# Altium schematic sheet FrontDoorConnecteur.SchDoc
size Letter; Organization: Cegep Limoilou; Address1: 1300, 8e Avenue; Address2: Québec, QC; Address3: Canada; Address4: G1J 5L5; Revision: Enseignants; SheetNumber: 2; SheetTotal: 8; Conception: Ilyes Gharmoul; Titre: Connecteur FrontDoor; Modification: Ilyes G
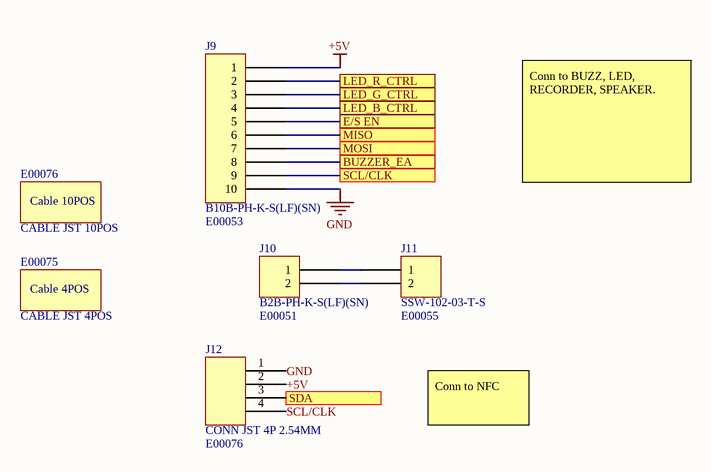
[diagram p0: FrontDoorConnecteur.SchDoc]

## Parts
H1  CABLE JST 10POS  ADAM Inventory Number 1: E00076
H2  CABLE JST 4POS  ADAM Inventory Number 1: E00075
J9  B10B-PH-K-S(LF)(SN)  ADAM Inventory Number 1: E00053  [CONN JST 10PIN]
J10  B2B-PH-K-S(LF)(SN)  ADAM Inventory Number 1: E00051  [CONN JST 2PIN]
J11  SSW-102-03-T-S  ADAM Inventory Number 1: E00055  [CONN FEM HEADER 2PIN]
J12  CONN JST 4P 2.54MM  ADAM Inventory Number 1: E00076  [MOLEX KK 0022272041]

## Ports
BUZZER_EA, E/S EN, LED_B_CTRL, LED_G_CTRL, LED_R_CTRL, MISO, MOSI, SCL/CLK, SDA

## Nets
+5V: J9.1 J12.2
GND: J9.10 J12.1
BUZZER_EA: J9.8 ; port BUZZER_EA
E/S EN: J9.5 ; port E/S EN
LED_B_CTRL: J9.4 ; port LED_B_CTRL
LED_G_CTRL: J9.3 ; port LED_G_CTRL
LED_R_CTRL: J9.2 ; port LED_R_CTRL
MISO: J9.6 ; port MISO
MOSI: J9.7 ; port MOSI
SCL/CLK: J9.9 ; port SCL/CLK
SCL/CLK: J12.4  [a separate net that carries the same name]
SDA: J12.3 ; port SDA
NetJ10_1: J10.1 J11.1
NetJ10_2: J10.2 J11.2

## Notes on the sheet
- Conn to BUZZ, LED, RECORDER, SPEAKER.
- Conn to NFC
- Titre :
- Conception :
- Date :
- Modification :
- Heure :
- Révision :
- Feuille
- de
- Fichier :
- (in symbol CABLE JST 4POS NOFP) Cable 4POS
- (in symbol CABLE JST 10POS NOFP) Cable 10POS

## Library data of the parts
H1 = CABLE JST 10POS NOFP: No footprint, only for BOM; Manufacturer Part Number 1: A10KR10KR26E254A; Supplier 1: Digi-Key; Supplier Part Number 1: 455-3496-ND
H2 = CABLE JST 4POS NOFP: Manufacturer Part Number 1: 2177961041; Supplier 1: Mouser; Supplier Part Number 1: 538-217796-1041
J9 = CONN JST 10POS TH: CONN HEADER VERT 10POS 2MM; Manufacturer: JST Sales America Inc.; Contact Length - Mating: 0.130" (3.30mm); Contact Length - Post: 0.134" (3.40mm); Current Rating (Amps): 2A; Material Flammability Rating: UL94 V-0; Number of Positions: 10; Number of Positions Loaded: All; Overall Contact Length: 0.333" (8.45mm); Pitch - Mating: 0.079" (2.00mm); Shrouding: Shrouded - 4 Wall; Style: Board to Cable/Wire; Voltage Rating: 100V; Manufacturer Part Number 1: B10B-PH-K-S(LF)(SN); ComponentLink1Description: Datasheet; ComponentLink1URL: http://www.jst-mfg.com/product/pdf/eng/ePH.pdf; ComponentLink2Description: DigiKey Link; ComponentLink2URL: http://digikey.com/product-detail/en/jst-sales-america-inc/B10B-PH-K-S-LF-SN/455-1712-ND/926619; Connector Type: Header; Contact Finish - Mating: Tin; Contact Finish - Post: Tin; Contact Material: Brass; Contact Shape: Square; Contact Type: Male Pin; Fastening Type: Detent Lock; Insulation Color: Natural; Insulation Height: 0.236" (6.00mm); Insulation Material: Polyamide (PA66), Nylon 6/6; LastUpdated: 2020-01-12 22:31:09; Lifecycle Status: Active; Minimum Order: 1; Mounting Type: Through Hole; Number of Rows: 1; Operating Temperature: -25°C ~ 85°C; Packaging: Bulk; PartId: 33; Part Status: Active; Price: 0.46; Series: PH; Supplier 1: DigiKey; Supplier Part Number 1: 455-1712-ND; Termination: Press-Fit, Solder
J10 = CONN JST 2PIN TH: CONN HEADER VERT 2POS 2MM; Manufacturer: JST Sales America Inc.; Contact Length - Mating: 0.130" (3.30mm); Contact Length - Post: 0.134" (3.40mm); Current Rating (Amps): 2A; Material Flammability Rating: UL94 V-0; Number of Positions: 2; Number of Positions Loaded: All; Overall Contact Length: 0.333" (8.45mm); Pitch - Mating: 0.079" (2.00mm); Shrouding: Shrouded - 4 Wall; Style: Board to Cable/Wire; Voltage Rating: 100V; Manufacturer Part Number 1: B2B-PH-K-S(LF)(SN); ComponentLink1Description: Datasheet; ComponentLink1URL: http://www.jst-mfg.com/product/pdf/eng/ePH.pdf; ComponentLink2Description: DigiKey Link; ComponentLink2URL: http://digikey.com/product-detail/en/jst-sales-america-inc/B2B-PH-K-S-LF-SN/455-1704-ND/926611; Connector Type: Header; Contact Finish - Mating: Tin; Contact Finish - Post: Tin; Contact Material: Brass; Contact Shape: Square; Contact Type: Male Pin; Fastening Type: Detent Lock; Insulation Color: Natural; Insulation Height: 0.236" (6.00mm); Insulation Material: Polyamide (PA66), Nylon 6/6; LastUpdated: 2020-01-03 23:40:58; Lifecycle Status: Active; Minimum Order: 1; Mounting Type: Through Hole; Number of Rows: 1; Operating Temperature: -25°C ~ 85°C; Packaging: Bulk; PartId: 11; Part Status: Active; Price: 0.17; Series: PH; Supplier 1: DigiKey; Supplier Part Number 1: 455-1704-ND; Termination: Press-Fit, Solder
J11 = CONN FEM HEADER 2POS: CONN RCPT 2POS 0.1 TIN; Manufacturer: Samtec Inc.; Connector Type: Receptacle; Current Rating (Amps): 5.7A per Contact; Material Flammability Rating: UL94 V-0; Number of Positions: 2; Number of Positions Loaded: All; Style: Board to Board or Cable; Manufacturer Part Number 1: SSW-102-03-T-S; ComponentLink2Description: DigiKey Link; ComponentLink2URL: http://digikey.com/product-detail/en/samtec-inc/SSW-102-03-T-S/SSW-102-03-T-S-ND/7873010; Contact Finish - Mating: Tin; Contact Finish - Post: Tin; Contact Type: Forked; Fastening Type: Push-Pull; Insulation Color: Black; LastUpdated: 2022-06-21 15:06:02; Lifecycle Status: Active; Minimum Order: 1; Mounting Type: Through Hole; Number of Rows: 1; Operating Temperature: -55°C ~ 105°C; Packaging: Bulk; Part Status: Active; Price: 0.53; Series: SSW; Supplier 1: DigiKey; Supplier Part Number 1: SSW-102-03-T-S-ND; Termination: Solder
J12 = CONN JST 4P 2.54MM: Manufacturer Part Number 1: 0022272041; Supplier 1: Mouser; Supplier Part Number 1: 538-22-27-2041